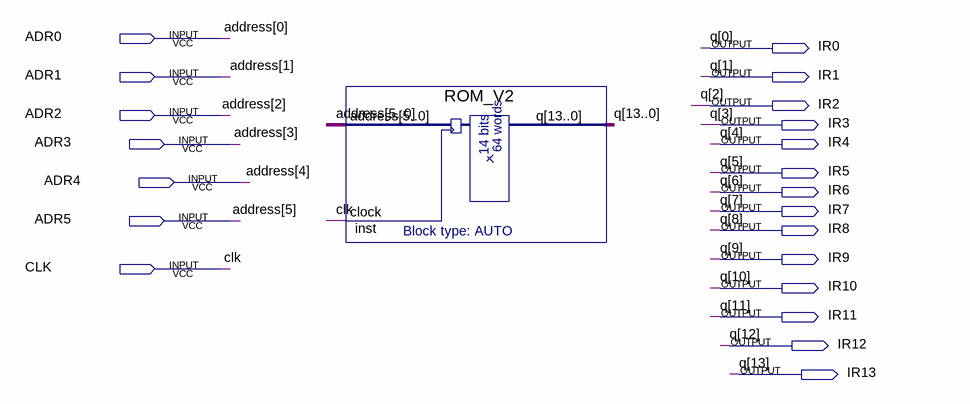
[diagram p0: schematic sheet]
// Quartus schematic ROM.bdf as structural Verilog: 1 symbols, 21 pins
module ROM (
  input  ADR0,
  input  ADR1,
  input  ADR2,
  input  ADR3,
  input  ADR4,
  input  ADR5,
  input  CLK,
  output IR0,
  output IR1,
  output IR2,
  output IR3,
  output IR4,
  output IR5,
  output IR6,
  output IR7,
  output IR8,
  output IR9,
  output IR10,
  output IR11,
  output IR12,
  output IR13
);

  ROM_V2 inst (
    .address({ADR5, ADR4, ADR3, ADR2, ADR1, ADR0}), .clock(CLK),
    .q({IR13, IR12, IR11, IR10, IR9, IR8, IR7, IR6, IR5, IR4, IR3, IR2, IR1, IR0}));

  // Other names for the same wires on the sheet: address[5:0] = {ADR5, ADR4, ADR3, ADR2, ADR1, ADR0};
  //   q[13:0] = {IR13, IR12, IR11, IR10, IR9, IR8, IR7, IR6, IR5, IR4, IR3, IR2, IR1, IR0}
endmodule
